# Altium schematic sheet Digital_Clock_Backup_SCH.SchDoc
size A; SheetNumber: 1; SheetTotal: 1
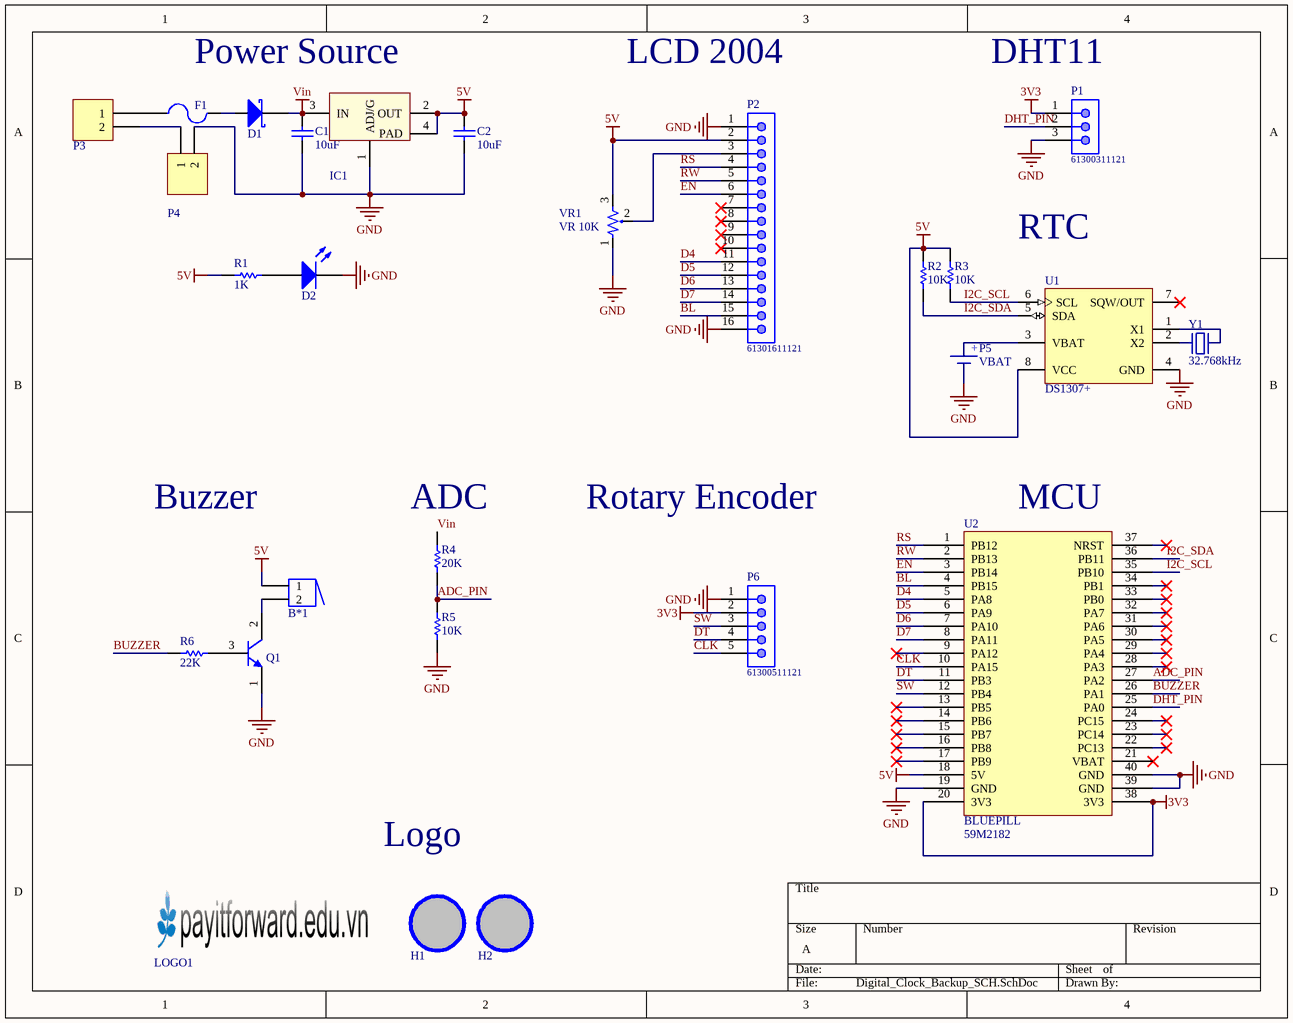
[diagram p0: Digital_Clock_Backup_SCH.SchDoc]

## Parts
B*1  Buzzer  [BUZZER]  (value not drawn)
C1  value 10uF  [CAP-SM-0805]  (hidden comment: Cap Non-Pol SMD)
C2  value 10uF  [CAP-SM-0805]  (hidden comment: Cap Non-Pol SMD)
D1  D Schottky  [SS34]  (value not drawn)
D2  LED  [LED-3mm]  (value not drawn)
F1  Fuse  [FUSE SMD]  (value not drawn)
H1  Hole  [LO KHOAN 3MM]  (value not drawn)
H2  Hole  [LO KHOAN 3MM]  (value not drawn)
IC1  LM1117  [SOT223-4N]  (value not drawn)
LOGO1  LOGO PIF  [PIF LOGO SMALL TOP]  (value not drawn)
P1  61300311121  [61300311121]
P2  61301611121  [61301611121]
P3  Domino 2  [DOMINO SMALL 2]  (value not drawn)
P4  Domino 2  [DOMINO SMALL 2]  (value not drawn)
P5  VBAT  [VBAT CR2030]
P6  61300511121  [61300511121]
Q1  C1815  [SOT23B]  (value not drawn)
R1  value 1K  [RES-SM-0805]  (hidden comment: RESISTOR SMD)
R2  value 10K  [RES-SM-0805]  (hidden comment: RESISTOR SMD)
R3  value 10K  [RES-SM-0805]  (hidden comment: RESISTOR SMD)
R4  value 20K  [RES-SM-0805]  (hidden comment: RESISTOR SMD)
R5  value 10K  [RES-SM-0805]  (hidden comment: RESISTOR SMD)
R6  value 22K  [RES-SM-0805]  (hidden comment: RESISTOR SMD)
U1  DS1307+  [MAXM-P8-1]
U2  BLUEPILL  Supplier Part Number 1: 59M2182  [BLUEPILL]
VR1  value VR 10K  [Varistor 1]  (hidden comment: 10K)
Y1  32.768kHz  [XTAL 32768 3x8]

## Nets
3V3: P1.1 P6.2 U2.20(3V3) U2.38(3V3)
5V: B*1.1 C2.2 IC1.2(OUT) IC1.4(PAD) P2.2 R1.1 R2.2 R3.2 U1.8(VCC) U2.18(5V) VR1.3
GND: C1.1 C2.1 D2.2(K) IC1.1(ADJ/G) P1.3 P2.1 P2.16 P4.2 P5.2(+) P6.1 Q1.1(E) R5.1 U1.4(GND) U2.19(GND) U2.39(GND) U2.40(GND) VR1.1
Vin: C1.2 D1.2(K) IC1.3(IN) R4.2
ADC_PIN: R4.1 R5.2 U2.27(PA2)
BL: P2.15 U2.4(PB15)
BUZZER: R6.1 U2.26(PA1)
CLK: P6.5 U2.10(PA15)
D4: P2.11 U2.5(PA8)
D5: P2.12 U2.6(PA9)
D6: P2.13 U2.7(PA10)
D7: P2.14 U2.8(PA11)
DHT_PIN: P1.2 U2.25(PA0)
DT: P6.4 U2.11(PB3)
EN: P2.6 U2.3(PB14)
I2C_SCL: R3.1 U1.6(SCL) U2.35(PB10)
I2C_SDA: R2.1 U1.5(SDA) U2.36(PB11)
RS: P2.4 U2.1(PB12)
RW: P2.5 U2.2(PB13)
SW: P6.3 U2.12(PB4)
NetB*1_2: B*1.2 Q1.2(C)
NetD1_1: D1.1(A) F1.2
NetD2_1: D2.1(A) R1.2
NetF1_1: F1.1 P3.1
NetP2_3: P2.3 VR1.2
NetP3_2: P3.2 P4.1
NetP5_1: P5.1(+) U1.3(VBAT)
NetQ1_3: Q1.3(B) R6.2
NetU1_1: U1.1(X1) Y1.2
NetU1_2: U1.2(X2) Y1.1

Not connected (* = marked no-connect by the designer): H1 1; H2 1; P2 7* 8* 9* 10*; U1 7(SQW/OUT)*; U2 9(PA12)* 13(PB5)* 14(PB6)* 15(PB7)* 16(PB8)* 17(PB9)* 21(VBAT)* 22(PC13)* 23(PC14)* 24(PC15)* 28(PA3)* 29(PA4)* 30(PA5)* 31(PA6)* 32(PA7)* 33(PB0)* 34(PB1)* 37(NRST)*

## Notes on the sheet
- Power Source
- LCD 2004
- (near P1) DHT11
- RTC
- Buzzer
- (near R4) ADC
- Rotary Encoder
- (near U2) MCU
- Logo

## Library data of the parts
C1 C2 = Cap Non-Pol SMD: Capacitor
D1 = D Schottky: Schottky Diode; Published: 8-Jun-2000; LatestRevisionDate: 17-Jul-2002; LatestRevisionNote: Re-released for DXP Platform.; PackageReference: SMB; Publisher: Altium Limited; PackageDescription: DO-214-AA/SMB; 2 C-Bend Leads; Body 5.3 x 3.6 mm, inc. leads (LxW); Code_JEDEC: DO-214-AA
H1 H2 = Hole: Hole 3mm
IC1 = LM1117: Available in 1.8V, 2.5V, 2.85V, 3.3V, 5V, and  Adjustable Versions; Value: LM317
P1 = 61300311121: WR-PHD Pin Header, THT, pitch 2.54mm, Single Row, Vertical, 3p; Manufacturer: Wurth Elektronik; Pin Number: 3; Rated Current: 3A; Working Voltage: 250VAC; Withstanding Voltage: 500VAC; Contact Resistance: 20mOhm; ComponentLink1Description: Manufacturer; ComponentLink1URL: http://www.we-online.de; ComponentLink2Description: Datasheet; ComponentLink2URL: https://www.we-online.com/catalog/datasheet/61300311121.pdf; Manufacturer Part Number: 61300311121; Published Date: May 2020; Pitch: 2.54mm; Operating Temperature: -40 to +105degC; Mounting Technology: THT; Packaging: Bag; Gender: Pin Header; Row Number: Single; Orientation: Vertical
P2 = 61301611121: WR-PHD Pin Header, THT, pitch 2.54mm, Single Row, Vertical, 16p; Manufacturer: Wurth Elektronik; Pin Number: 16; Rated Current: 3A; Working Voltage: 250VAC; Withstanding Voltage: 500VAC; Contact Resistance: 20mOhm; ComponentLink1Description: Manufacturer; ComponentLink1URL: http://www.we-online.de; ComponentLink2Description: Datasheet; ComponentLink2URL: https://www.we-online.com/catalog/datasheet/61301611121.pdf; Manufacturer Part Number: 61301611121; Published Date: May 2020; Pitch: 2.54mm; Operating Temperature: -40 to +105degC; Mounting Technology: THT; Packaging: Bag; Gender: Pin Header; Row Number: Single; Orientation: Vertical
P3 P4 = Domino 2: Domino, 2-Pin; LatestRevisionDate: 17-Jul-2002; LatestRevisionNote: Re-released for DXP Platform.; Publisher: Altium Limited
P5 = VBAT CR2032: CR2032; Manufacturer: DANTONA INDUSTRIES; Manufacturer Part Number: CR2032 SANYO; Supplier 1: Newark; RoHS: NA; Stock 1: 1694; Pricing 1: 1=0.768, 5=0.655, 10=0.615, 25=0.565, 50=0.51, 100=0.46, 250=0.41 (USD); ComponentLink1URL: http://www.farnell.com/datasheets/1797668.pdf; ComponentLink1Description: http://www.farnell.com/datasheets/1797668.pdf; ComponentLink2URL: /datasheets/DANTONA/CRSANYO.pdf; ComponentLink2Description: /datasheets/DANTONA/CRSANYO.pdf
P6 = 61300511121: WR-PHD Pin Header, THT, pitch 2.54mm, Single Row, Vertical, 5p; Manufacturer: Wurth Elektronik; Pin Number: 5; Rated Current: 3A; Working Voltage: 250VAC; Withstanding Voltage: 500VAC; Contact Resistance: 20mOhm; ComponentLink1Description: Manufacturer; ComponentLink1URL: http://www.we-online.de; ComponentLink2Description: Datasheet; ComponentLink2URL: https://www.we-online.com/catalog/datasheet/61300511121.pdf; Manufacturer Part Number: 61300511121; Published Date: May 2020; Pitch: 2.54mm; Operating Temperature: -40 to +105degC; Mounting Technology: THT; Packaging: Bag; Gender: Pin Header; Row Number: Single; Orientation: Vertical
Q1 = C1815: NPN Bipolar Transistor
R1-R6 = RESISTOR SMD: Resistor
U1 = CMP-016-00004-3: I2C Real-Time Clock, 5 V, 0 to 70 degC, 8-Pin DIP, RoHS, Tube; Manufacturer: Maxim; Min Supply Voltage: 4.5V; Interface: Serial; Nominal Supply Voltage: 5V; Package Version: Rev. E, 04/2011; Max Supply Voltage: 5.5V; RoHS Compliant: True; Manufacturer URL: http://www.maximintegrated.com/; Datasheet Version: Rev. 100208, 10/2008; Datasheet URL: https://datasheet.ciiva.com/20167/82-0567-20167410.pdf; Mounting Technology: TH; Package Quantity: 50; Packaging: Rail/Tube; Package Description: 8-Pin Plastic Dual-In-Line, Narrow (0.3in) (P8-1), Body 9.375 x 6.985 mm, Pitch 2.54 mm; Case/Package: DIP; Min Operating Temperature: 0°C; Package URL: http://pdfserv.maximintegrated.com/package_dwgs/21-0043.PDF; Pins: 8; Max Operating Temperature: 70°C; Package Reference: P8-1
U2 = BLUEPILL: Development board STM32F103C8T6; Supplier 1: Newark
VR1 = Var Resistor
Y1 = XTAL: Crystal For all Crystal 2pin